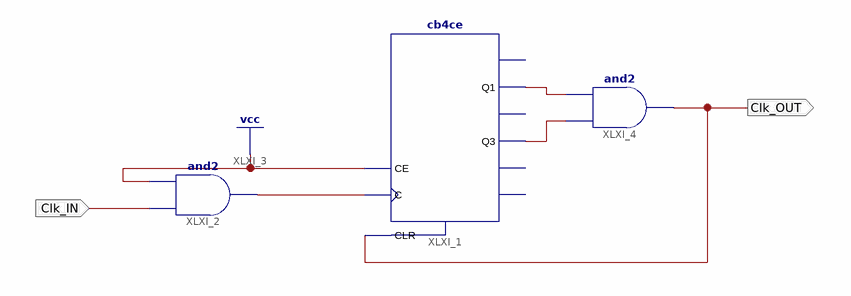
[diagram p0: schematic sheet 1]
// Xilinx ISE schematic div10.sch (spartan6) as structural Verilog: 3 symbols, 2 ports
module div10 (
  input  Clk_IN,
  output Clk_OUT
);

  wire XLXN_1, XLXN_3, XLXN_4;

  cb4ce XLXI_1 (.C(XLXN_1), .CE(1'b1), .CLR(Clk_OUT), .Q1(XLXN_3), .Q3(XLXN_4));  // open: CEO, Q0, Q2, TC
  and XLXI_2 (XLXN_1, Clk_IN, 1'b1);
  and XLXI_4 (Clk_OUT, XLXN_4, XLXN_3);
endmodule
